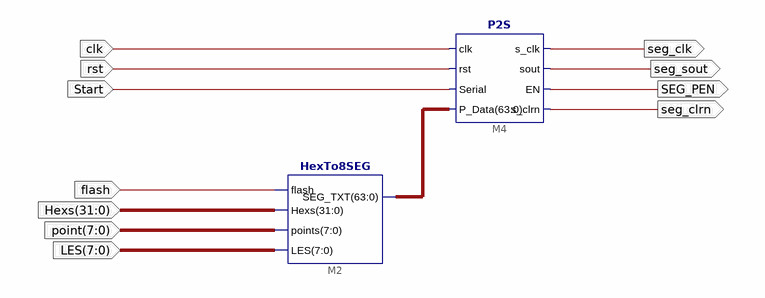
[diagram p0: schematic sheet 1]
// Xilinx ISE schematic Sseg_Dev.sch (kintex7) as structural Verilog: 2 symbols, 11 ports
module Sseg_Dev (
  input  clk,
  input  rst,
  input  Start,
  input  flash,
  input  [31:0] Hexs,
  input  [7:0] point,
  input  [7:0] LES,
  output seg_clk,
  output seg_sout,
  output SEG_PEN,
  output seg_clrn
);

  wire [63:0] XLXN_4;

  HexTo8SEG M2 (.LES(LES), .points(point), .Hexs(Hexs), .SEG_TXT(XLXN_4), .flash(flash));
  P2S M4 (
    .s_clrn(seg_clrn), .sout(seg_sout), .rst(rst), .EN(SEG_PEN), .Serial(Start), .clk(clk), .s_clk(seg_clk),
    .P_Data(XLXN_4));
endmodule
